# Altium project ROKET 2023.PrjPcb
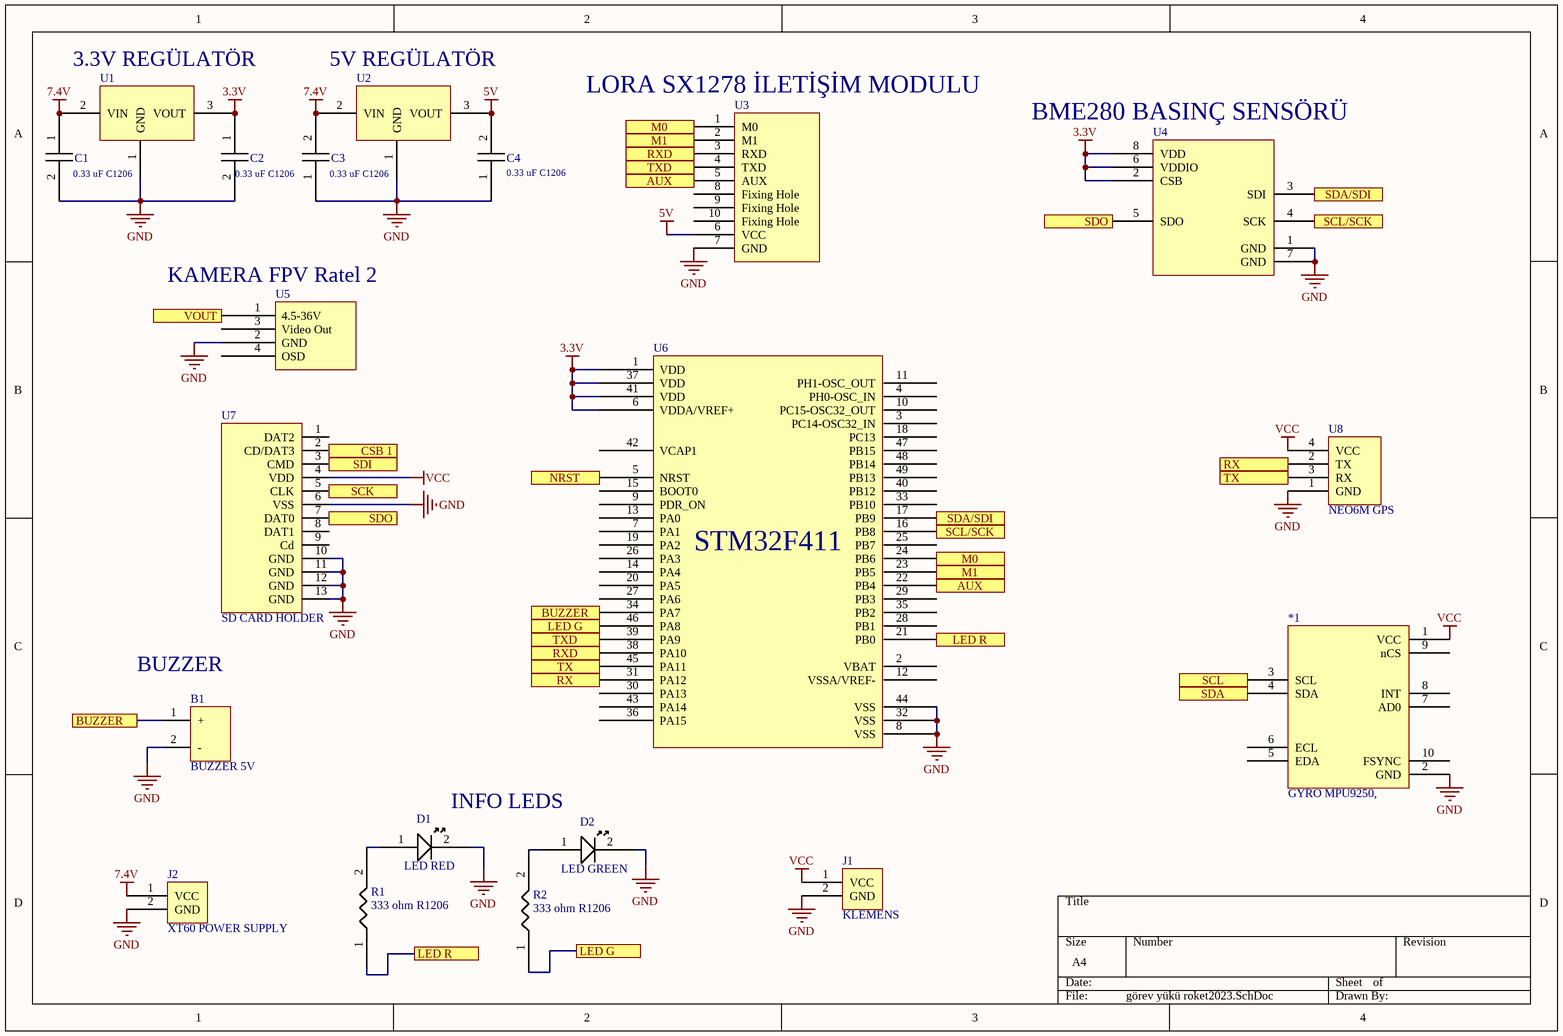
[diagram p0: görev yükü roket2023.SchDoc]
1 sheet, 20 parts. Net scope: flat (ports and power ports of the same name join across sheets).

## Sheet görev yükü roket2023.SchDoc
size A4; SheetNumber: 1; SheetTotal: 1

### Parts
*1  GYRO MPU9250,  [PCBComponent_1]
B1  BUZZER 5V  [BUZZER]
C1  0.33 uF C1206  [C1206]
C2  0.33 uF C1206  [C1206]
C3  0.33 uF C1206  [C1206]
C4  0.33 uF C1206  [C1206]
D1  LED RED  [LED D1206]
D2  LED GREEN  [LED D1206]
J1  KLEMENS  [KLEMENS]
J2  XT60 POWER SUPPLY  [KLEMENS]
R1  333 ohm R1206  [R1206]
R2  333 ohm R1206  [R1206]
U1  3.3V REGÜLATÖR  [L7805CDT-TR DPAK]
U2  5V REGÜLATÖR  [L7805CDT-TR DPAK]
U3  LORA SX1278 İLETİŞİM MODULU  [QFN65P600X600X100_HS-29N]
U4  BME280 BASINÇ SENSÖRÜ  [BME280]
U5  KAMERA FPV Ratel 2  [PCBComponent_1]
U6  STM32F411  [PCBComponent_1]
U7  SD CARD HOLDER  [SD CARD HOLDER]
U8  NEO6M GPS  [PCBComponent_1]

### Ports
AUX (see görev yükü roket2023[2A]), AUX (see görev yükü roket2023[3C]), BUZZER (see görev yükü roket2023[1C]), BUZZER (see görev yükü roket2023[2C]), CSB 1, LED G (see görev yükü roket2023[2C]), LED G (see görev yükü roket2023[2D]), LED R (see görev yükü roket2023[2D]), LED R (see görev yükü roket2023[3C]), M0 (see görev yükü roket2023[2A]), M0 (see görev yükü roket2023[3C]), M1 (see görev yükü roket2023[2A]), M1 (see görev yükü roket2023[3C]), NRST, RX (see görev yükü roket2023[2C]), RX (see görev yükü roket2023[4B]), RXD (see görev yükü roket2023[2A]), RXD (see görev yükü roket2023[2C]), SCK, SCL, SCL/SCK (see görev yükü roket2023[3C]), SCL/SCK (see görev yükü roket2023[4A]), SDA, SDA/SDI (see görev yükü roket2023[3C]), SDA/SDI (see görev yükü roket2023[4A]), SDI, SDO (see görev yükü roket2023[1C]), SDO (see görev yükü roket2023[3A]), TX (see görev yükü roket2023[2C]), TX (see görev yükü roket2023[4B]), TXD (see görev yükü roket2023[2A]), TXD (see görev yükü roket2023[2C]), VOUT

### Nets
3.3V: C2.1 U1.3(VOUT) U4.2(CSB) U4.6(VDDIO) U4.8(VDD) U6.1(VDD) U6.6(VDDA/VREF+) U6.37(VDD) U6.41(VDD)
5V: C4.2 U2.3(VOUT) U3.6(VCC)
7.4V: C1.1 C3.2 J2.1(VCC) U1.2(VIN) U2.2(VIN)
GND: *1.2(GND) B1.2(-) C1.2 C2.2 C3.1 C4.1 D1.2 D2.2 J1.2(GND) J2.2(GND) U1.1(GND) U2.1(GND) U3.7(GND) U4.1(GND) U4.7(GND) U5.2(GND) U6.8(VSS) U6.32(VSS) U6.44(VSS) U7.6(VSS) U7.10(GND) U7.11(GND) U7.12(GND) U7.13(GND) U8.1(GND)
VCC: *1.1(VCC) J1.1(VCC) U7.4(VDD) U8.4(VCC)
Net*1_3: *1.3(SCL) ; port SCL
Net*1_4: *1.4(SDA) ; port SDA
NetB1_1: B1.1(+) U6.34(PA7) ; port BUZZER
NetD1_1: D1.1 R1.2
NetD2_1: D2.1 R2.2
NetR1_1: R1.1 U6.21(PB0) ; port LED R
NetR2_1: R2.1 U6.46(PA8) ; port LED G
NetU3_1: U3.1(M0) U6.24(PB6) ; port M0
NetU3_2: U3.2(M1) U6.23(PB5) ; port M1
NetU3_3: U3.3(RXD) U6.38(PA10) ; port RXD
NetU3_4: U3.4(TXD) U6.39(PA9) ; port TXD
NetU3_5: U3.5(AUX) U6.22(PB4) ; port AUX
NetU4_3: U4.3(SDI) U6.17(PB9) ; port SDA/SDI
NetU4_4: U4.4(SCK) U6.16(PB8) ; port SCL/SCK
NetU4_5: U4.5(SDO) U7.7(DAT0) ; port SDO
NetU5_1: U5.1(4.5-36V) ; port VOUT
NetU6_5: U6.5(NRST) ; port NRST
NetU6_31: U6.31(PA12) U8.2(TX) ; port RX
NetU6_45: U6.45(PA11) U8.3(RX) ; port TX
NetU7_2: U7.2(CD/DAT3) ; port CSB 1
NetU7_3: U7.3(CMD) ; port SDI
NetU7_5: U7.5(CLK) ; port SCK

Not connected (* = marked no-connect by the designer): *1 5(EDA) 6(ECL) 7(AD0) 8(INT) 9(nCS) 10(FSYNC); U3 8(Fixing_Hole) 9(Fixing_Hole) 10(Fixing_Hole); U5 3(Video_Out) 4(OSD); U6 2(VBAT) 3(PC14-OSC32_IN) 4(PH0-OSC_IN) 7(PA1) 9(PDR_ON) 10(PC15-OSC32_OUT) 11(PH1-OSC_OUT) 12(VSSA/VREF-) 13(PA0) 14(PA4) 15(BOOT0) 18(PC13) 19(PA2) 20(PA5) 25(PB7) 26(PA3) 27(PA6) 28(PB1) 29(PB3) 30(PA13) 33(PB10) 35(PB2) 36(PA15) 40(PB12) 42(VCAP1) 43(PA14) 47(PB15) 48(PB14) 49(PB13); U7 1(DAT2) 8(DAT1) 9(Cd)

### Notes on the sheet
- (near B1) BUZZER
- INFO LEDS

### Library data of the parts
*1 U8 = Component_1
B1 = BUZZER 5V: buzzer
J2 = KLEMENS
U1 U2 = LD1086DT33TR: 3.3v dpak regulator
U3 = LORASX1278
U4 = BME280
U5 = FPV Ratel 2